# Altium schematic sheet STM32_AUX.SchDoc
size A4; SheetNumber: 8; SheetTotal: 9
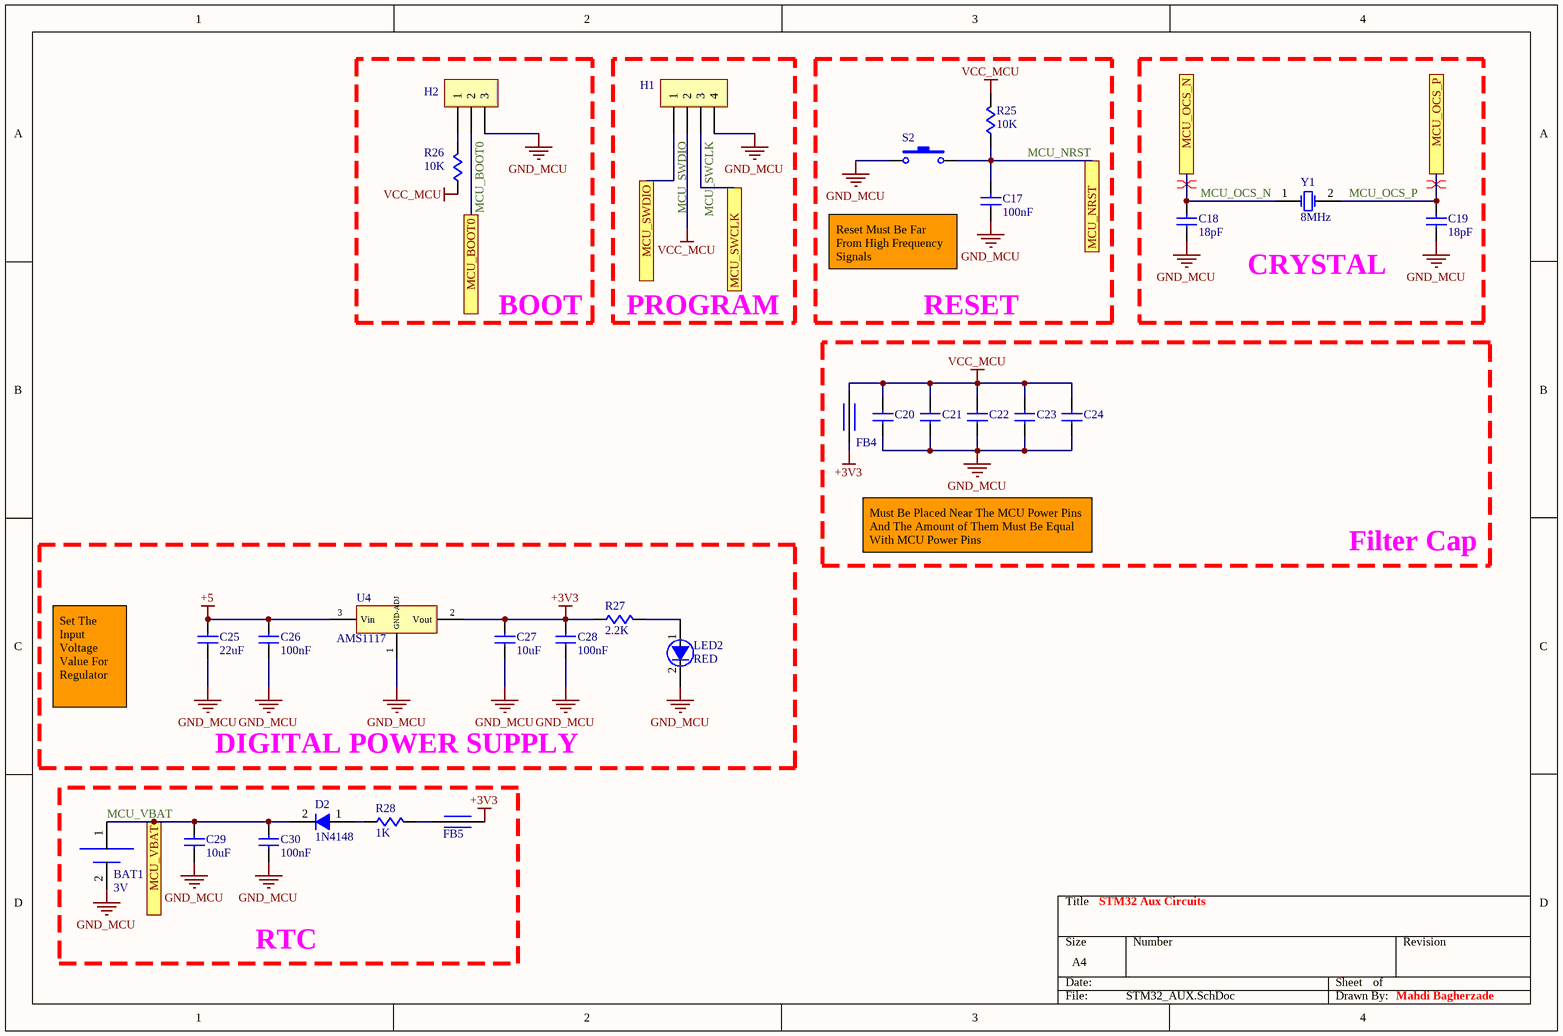
[diagram p0: STM32_AUX.SchDoc]

## Parts
BAT1  Voltage: 3V  [BAT-HOLDER-SMD-1220]  (hidden comment: Bat Holder 2016-SMD)
C17  value 100nF  [C-0805]  (hidden comment: CAP Cer 100nF-50V-X7R-SMD)
C18  value 18pF  [C-0805]  (hidden comment: CAP Cer 18pF-50V-X7R-SMD)
C19  value 18pF  [C-0805]  (hidden comment: CAP Cer 18pF-50V-X7R-SMD)
C20  CAP Cer 100nF-50V-X7R-SMD  [C-0805]  (value not drawn)
C21  CAP Cer 100nF-50V-X7R-SMD  [C-0805]  (value not drawn)
C22  CAP Cer 100nF-50V-X7R-SMD  [C-0805]  (value not drawn)
C23  CAP Cer 100nF-50V-X7R-SMD  [C-0805]  (value not drawn)
C24  CAP Cer 100nF-50V-X7R-SMD  [C-0805]  (value not drawn)
C25  value 22uF  [C-0805]  (hidden comment: CAP Cer 22uF-50V-X7R-SMD)
C26  value 100nF  [C-0805]  (hidden comment: CAP Cer 100nF-50V-X7R-SMD)
C27  value 10uF  [C-0805]  (hidden comment: CAP Cer 10uF-50V-X7R-SMD)
C28  value 100nF  [C-0805]  (hidden comment: CAP Cer 100nF-50V-X7R-SMD)
C29  value 10uF  [C-0805]  (hidden comment: CAP Cer 10uF-50V-X7R-SMD)
C30  value 100nF  [C-0805]  (hidden comment: CAP Cer 100nF-50V-X7R-SMD)
D2  Code: 1N4148  [SOD80]  (hidden comment: Diode 1N4148-SMD)
FB4  FERRITE BEAD  [FB-0805]  (value not drawn)
FB5  Ferrite Bead SMD  [FB-0805]  (value not drawn)
H1  Header 4x1 Pin -Straight-Male-2.54mm  [H-4pin-M-S]  (value not drawn)
H2  Header 3x1 Pin -Straight-Male-2.54mm  [H-3pin-M-S]  (value not drawn)
LED2  Color: RED  [LED-1206-R]  (hidden comment: LED RED-1206-SMD)
R25  value 10K  [R-0805]  (hidden comment: RES 10K-5%-1/8W-SMD)
R26  value 10K  [R-0805]  (hidden comment: RES 10K-5%-1/8W-SMD)
R27  value 2.2K  [R-0805]  (hidden comment: RES 2.2K-5%-1/8W-SMD)
R28  value 1K  [R-0805]  (hidden comment: RES 1K-5%-1/8W-SMD)
S2  Push Button 3x6mm-2Pin-SMD  [SW-SMD-2pin-3x6]  (value not drawn)
U4  Reg AMS1117-3.3V-SMD  [SOT223]  (value not drawn)
Y1  value 8MHz  [CRYSTAL-SMD]  (hidden comment: Crystal 8MHz-SMD)

## Blocks framed on the sheet
BOOT: H2 R26
PROGRAM: H1
RESET: C17 R25 S2
CRYSTAL: C18 C19 Y1
Filter Cap: C20-C24 FB4
DIGITAL POWER SUPPLY: C25-C28 LED2 R27 U4
RTC: BAT1 C29 C30 D2 FB5 R28

## Ports
MCU_BOOT0 (see Interface[7A], MCU[4C]), MCU_NRST (see Interface[7B], MCU[4C]), MCU_OCS_N (see Interface[7B], MCU[4B]), MCU_OCS_P (see Interface[7B], MCU[4B]), MCU_SWCLK (see Interface[7A], MCU[2B]), MCU_SWDIO (see Interface[7A], MCU[2B]), MCU_VBAT (see Interface[7B], MCU[2C])

## Nets
+3V3: C27.2 C28.2 FB4.1 FB5.1 R27.1 U4.2(Vout)
+5: C25.2 C26.2 U4.3(Vin)
GND_MCU: BAT1.2(-) C17.1 C18.1 C19.1 C20.2 C21.2 C22.2 C23.2 C24.2 C25.1 C26.1 C27.1 C28.1 C29.1 C30.1 H1.4 H2.3 LED2.2(C) S2.1 U4.1(GND-ADJ)
VCC_MCU: C20.1 C21.1 C22.1 C23.1 C24.1 FB4.2 H1.2 R25.2 R26.1
MCU_BOOT0: H2.2 ; port MCU_BOOT0
MCU_NRST: C17.2 R25.1 S2.2 ; port MCU_NRST
MCU_OCS_N: C18.2 Y1.1(OSC1) ; port MCU_OCS_N
MCU_OCS_P: C19.2 Y1.2(OSC2) ; port MCU_OCS_P
MCU_SWCLK: H1.3 ; port MCU_SWCLK
MCU_SWDIO: H1.1 ; port MCU_SWDIO
MCU_VBAT: BAT1.1(+) C29.2 C30.2 D2.2(C) ; port MCU_VBAT
NetD2_1: D2.1(A) R28.1
NetFB5_2: FB5.2 R28.2
NetH2_1: H2.1 R26.2
NetLED2_1: LED2.1(A) R27.2

## Layout directives
differential pair: MCU_OCS_N, MCU_OCS_P

## Notes on the sheet
- Reset Must Be Far From High Frequency Signals
- Must Be Placed Near The MCU Power Pins And The Amount of Them Must Be Equal With MCU Power Pins
- Set The Input Voltage Value For Regulator
- STM32 Aux Circuits
- Mahdi Bagherzade

## Library data of the parts
BAT1 = BATTERY HOLDER: BATTERY; Phone Number: 0915 8700 314; Publisher: Mahdi Bagherzadeh; ComponentLink1Description: Linkedin; ComponentLink1URL: https://ir.linkedin.com/in/mahdi-bagherzade; Published Date: 9-15-2024; Size: 2016; Type: SMD
C17-C19 C25-C30 = CAP-CER: CAPACITOR; Phone Number: 0915 8700 314; Voltage: 50V; Tolerance: X7R; Type: SMD; Publisher: Mahdi Bagherzadeh; ComponentLink1Description: Linkedin; ComponentLink1URL: https://ir.linkedin.com/in/mahdi-bagherzade; Published Date: 9-15-2024
C20-C24 = CAP-CER: CAPACITOR; Phone Number: 0915 8700 314; Voltage: 50V; Tolerance: X7R; Type: SMD; Value: 100nF; Publisher: Mahdi Bagherzadeh; ComponentLink1Description: Linkedin; ComponentLink1URL: https://ir.linkedin.com/in/mahdi-bagherzade; Published Date: 9-15-2024
D2 = DIODE: Phone Number: 0915 8700 314; Type: SMD; Publisher: Mahdi Bagherzadeh; ComponentLink1Description: Linkedin; ComponentLink1URL: https://ir.linkedin.com/in/mahdi-bagherzade; Published Date: 9-15-2024
FB4 FB5 = FERRITE BEAD: INDUCATOR; Phone Number: 0915 8700 314; Publisher: Mahdi Bagherzadeh; ComponentLink1Description: Linkedin; ComponentLink1URL: https://ir.linkedin.com/in/mahdi-bagherzade; Published Date: 9-15-2024
  FB5: Type: SMD
H1 = HEADER-4pin: HEADER; Phone Number: 0915 8700 314; Publisher: Mahdi Bagherzadeh; ComponentLink1Description: Linkedin; ComponentLink1URL: https://ir.linkedin.com/in/mahdi-bagherzade; Published Date: 9-15-2024; Type: Straight-Male; Size: 2.54mm
H2 = HEADER-3pin: HEADER; Phone Number: 0915 8700 314; Publisher: Mahdi Bagherzadeh; ComponentLink1Description: Linkedin; ComponentLink1URL: https://ir.linkedin.com/in/mahdi-bagherzade; Published Date: 9-15-2024; Type: Straight-Male; Size: 2.54mm
LED2 = LED: Phone Number: 0915 8700 314; Type: SMD; Publisher: Mahdi Bagherzadeh; ComponentLink1Description: Linkedin; ComponentLink1URL: https://ir.linkedin.com/in/mahdi-bagherzade; Published Date: 9-15-2024; Size: 1206
R25-R28 = RES: RESISTOR; Phone Number: 0915 8700 314; Tolerance: 5%; Power: 1/8W; Publisher: Mahdi Bagherzadeh; ComponentLink1Description: Linkedin; ComponentLink1URL: https://ir.linkedin.com/in/mahdi-bagherzade; Published Date: 9-15-2024; Type: SMD
S2 = PUSH BUTTON: SWITCH; Phone Number: 0915 8700 314; Publisher: Mahdi Bagherzadeh; ComponentLink1Description: Linkedin; ComponentLink1URL: https://ir.linkedin.com/in/mahdi-bagherzade; Published Date: 9-15-2024; Size: 3x6mm; Type: 2Pin-SMD
U4 = AMS1117: REGULATOR; Phone Number: 0915 8700 314; Voltage: 3.3V; Publisher: Mahdi Bagherzadeh; ComponentLink1Description: Linkedin; ComponentLink1URL: https://ir.linkedin.com/in/mahdi-bagherzade; Published Date: 9-15-2024; Type: SMD; Code: AMS1117
Y1 = CRYSTAL: Phone Number: 0915 8700 314; Publisher: Mahdi Bagherzadeh; ComponentLink1Description: Linkedin; ComponentLink1URL: https://ir.linkedin.com/in/mahdi-bagherzade; Published Date: 9-15-2024; Type: SMD